# Altium schematic sheet Lcd connector.SchDoc
size A
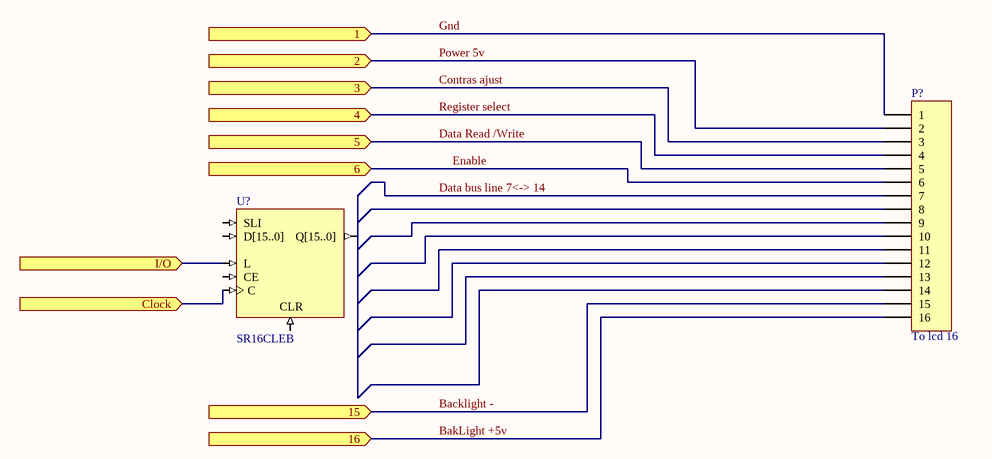
[diagram p0: Lcd connector.SchDoc]

## Parts
P?  To lcd 16  [HDR1X16]
U?  SR16CLEB

## Ports
1 (in), 2 (in), 3 (in), 4 (in), 5 (in), 6 (in), 15 (in), 16 (in), Clock (in), I/O (in)

## Nets
Backlight -: P?.15 ; port 15
BakLight +5v: P?.16 ; port 16
Clock: U?.C ; port Clock
Contras ajust: P?.3 ; port 3
Data bus line 7<-> 14: P?.7
Data Read /Write: P?.5 ; port 5
Enable: P?.6 ; port 6
Gnd: P?.1 ; port 1
I/O: U?.L ; port I/O
Power 5v: P?.2 ; port 2
Register select: P?.4 ; port 4

Not connected (* = marked no-connect by the designer): P? 8 9 10 11 12 13 14; U? CE CLR D[15..0] Q[15..0] SLI

## Library data of the parts
P? = Header 16: Header, 16-Pin; LatestRevisionDate: 17-Jul-2002; LatestRevisionNote: Re-released for DXP Platform.; Publisher: Altium Limited
U? = SR16CLEB: 16-Bit Loadable Serial/Parallel-In Parallel-Out Shift Registers with Clock Enable and Asynchronous Clear, Bus Version; ClockTrigger: Rising; Enable: High; Loadable: True; PortSize: 16; ArchiveName: GENERIC; VHDLIB_SIM: GENERIC_LIB; Published: 29-Jan-2004; Publisher: Altium Limited; XilinxEquivalent: SR16CLE; LastRevisionNo: 1.00.00; HelpURL: CR0118 FPGA Generic Library Guide.pdf#page=432; ComponentLink1URL: CR0141 FPGA Shift Register Resource Usage.pdf#page=28; ComponentLink1Description: Core &Resource Usage; FunctionalClass: Shift Register; Reset: Asynchronous; PortStyle: Bus Version